# Altium project Back_Breakout.PrjPcb
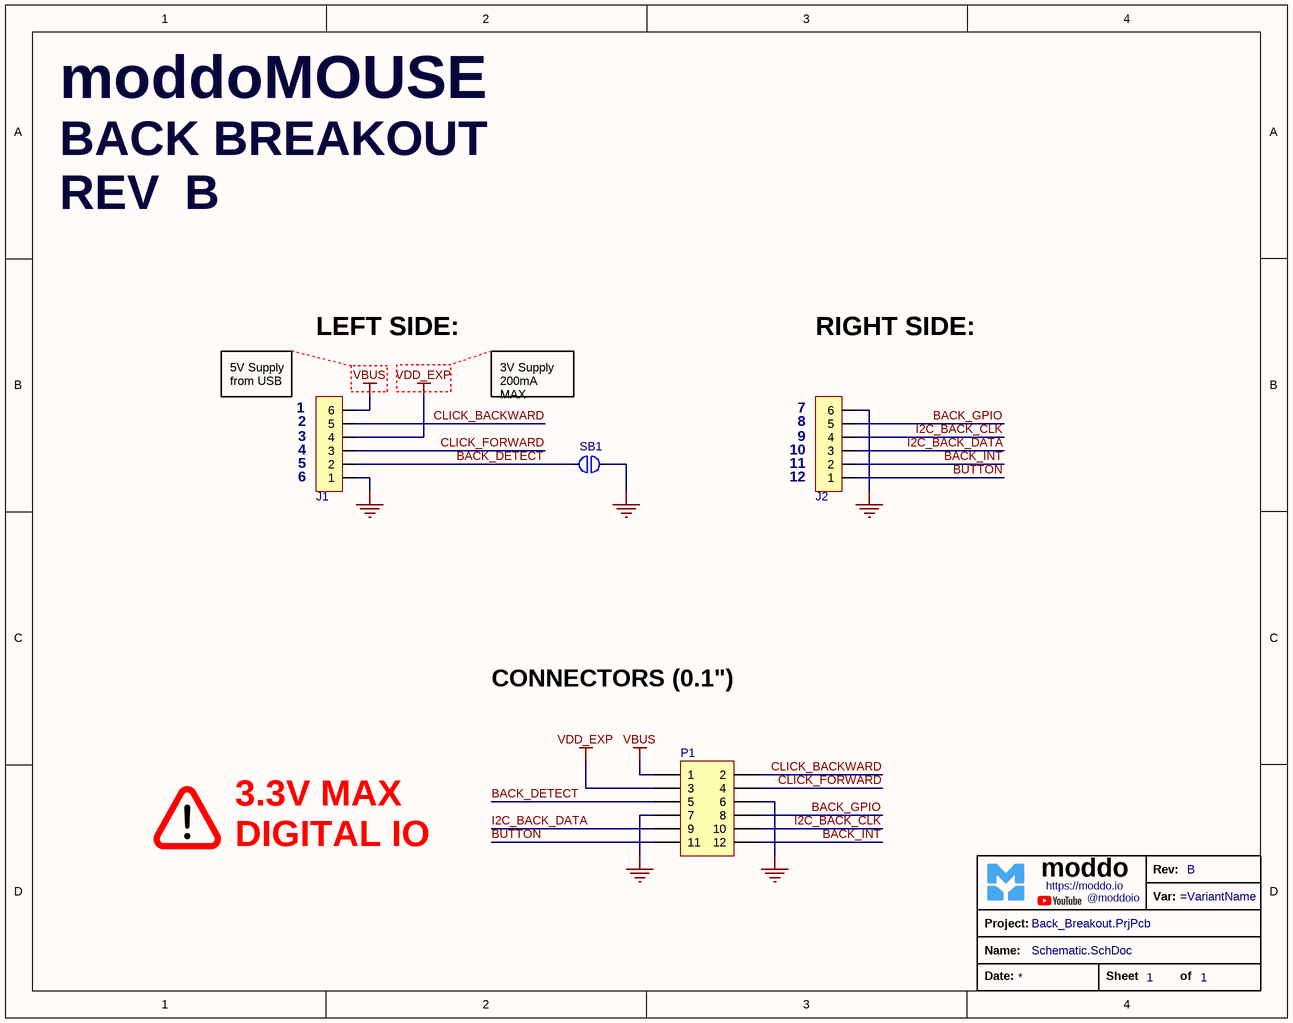
[diagram p0: Schematic.SchDoc]
Revision: B
1 sheet, 5 parts. Net scope: global (net labels, ports and power ports of the same name join across sheets).
Board files: PCB.PcbDoc, PcbPanel.PcbDoc

## Sheet Schematic.SchDoc
size A; SheetNumber: 1; SheetTotal: 1

### Parts
?  TitleBlock_moddo  (value not drawn)  (graphical)
J1  1.27mm_6pins  [1.27mm_6pins_MaleHeader_RightAngle]  (value not drawn)
J2  1.27mm_6pins  [1.27mm_6pins_MaleHeader_RightAngle]  (value not drawn)
P1  Header 6X2  [HEADER_2_54_F_2X6]  (value not drawn)
SB1  Solderbridge  [Solderbridge]  (value not drawn)  (no BOM)

### Nets
GND: J1.1 J2.6 P1.6 P1.7 SB1.1
VBUS: J1.6 P1.1
VDD_EXP: J1.4 P1.3
BACK_DETECT: J1.2 P1.5 SB1.2
BACK_GPIO: J2.5 P1.8
BACK_INT: J2.2 P1.12
BUTTON: J2.1 P1.11
CLICK_BACKWARD: J1.5 P1.2
CLICK_FORWARD: J1.3 P1.4
I2C_BACK_CLK: J2.4 P1.10
I2C_BACK_DATA: J2.3 P1.9

### Notes on the sheet
- moddoMOUSE <https://protorig.io/>
- BACK BREAKOUT <https://protorig.io/>
- REV
- LEFT SIDE:
- RIGHT SIDE:
- (near J1) 5V Supply
  from USB
- (near J1) 1
- (near J1) 2
- 3V Supply
  200mA MAX
- (near J2) 7
- (near J2) 8
- (near J1) 3
- (near J1) 4
- (near J1) 5
- (near J1) 6
- (near J2) 9
- (near J2) 10
- (near J2) 11
- (near J2) 12
- CONNECTORS (0.1")
- 3.3V MAX
- DIGITAL IO
- (in symbol TitleBlock_moddo) Rev:; moddo; https://moddo.io; Var:; @moddoio; Project:; Name:; Date:; Sheet; of

### Library data of the parts
J1 J2 = 1.27mm_6pins_male_rightangle
P1 = Header 6X2: Header, 6-Pin, Dual row; Manufacturer: Adam Tech; Manufacturer Part Number: RS2-12-G; LatestRevisionDate: 17-Jul-2002; LatestRevisionNote: Re-released for DXP Platform.; Publisher: Altium Limited
SB1 = SOLDERBRIDGE: Artikkelnr Noca: N.A.; Part Number: Solderbridge; Manufacturer: *; Manufacturer Part Number: *; Datasheet: *; LatestRevisionDate: 2009-12-14; Pin Count: 2; Publisher: Nordic Semiconductor; Published: 2009-12-14; Value: Solderbridge; Note: *; Supplier: *; Supplier part number: *; 2nd source Supplier: *; 2nd source part number: *; Footprint Doc: Solderbridge; Artikkelnr Simpro: N.A.

## Assembly variants
Main: all parts fitted